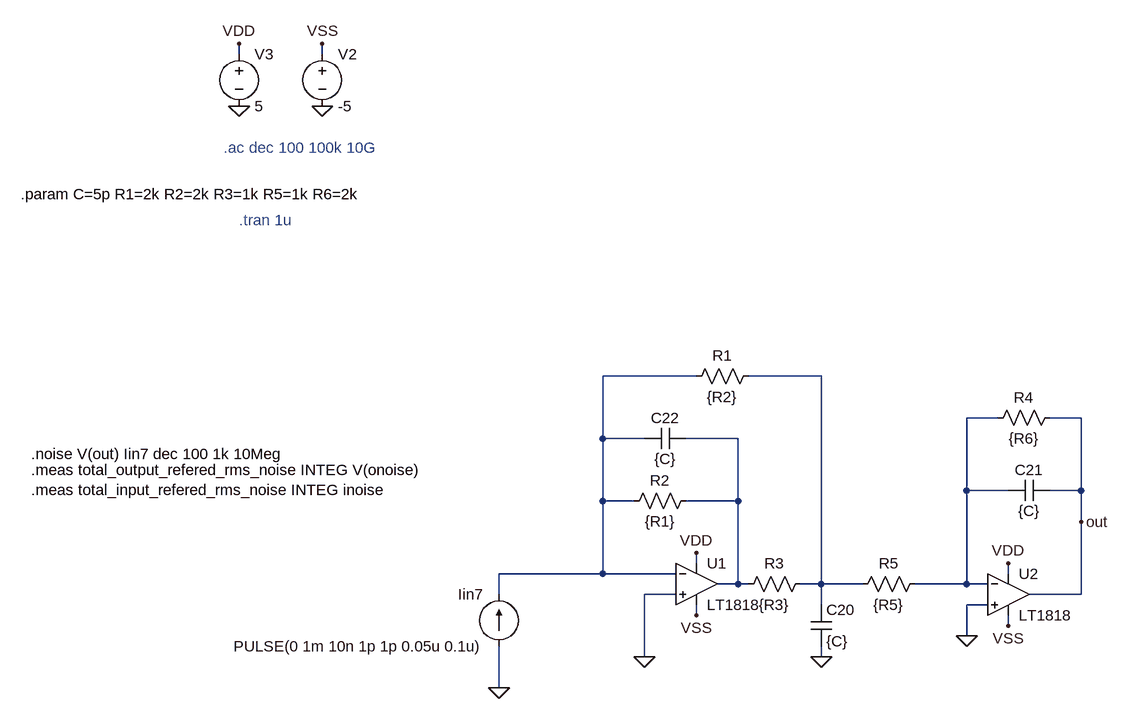
[diagram p0: schematic TIA-ALL_Z-LPF-Noise.asc]
TIA-ALL_Z-LPF-Noise.asc, the LTspice schematic file:
Version 4
SHEET 1 3536 3016
WIRE -128 -16 -128 -32
WIRE 0 -16 0 -32
WIRE 576 480 432 480
WIRE 768 480 656 480
WIRE 1040 544 992 544
WIRE 1168 544 1120 544
WIRE 432 576 432 480
WIRE 496 576 432 576
WIRE 640 576 560 576
WIRE 992 656 992 544
WIRE 1056 656 992 656
WIRE 1168 656 1168 544
WIRE 1168 656 1120 656
WIRE 432 672 432 576
WIRE 480 672 432 672
WIRE 640 672 640 576
WIRE 640 672 560 672
WIRE 1168 704 1168 656
WIRE 576 768 576 752
WIRE 432 784 432 672
WIRE 432 784 272 784
WIRE 544 784 432 784
WIRE 1056 784 1056 768
WIRE 640 800 640 672
WIRE 640 800 608 800
WIRE 656 800 640 800
WIRE 768 800 768 480
WIRE 768 800 736 800
WIRE 832 800 768 800
WIRE 992 800 992 656
WIRE 992 800 912 800
WIRE 1024 800 992 800
WIRE 272 816 272 784
WIRE 544 816 496 816
WIRE 1168 816 1168 704
WIRE 1168 816 1088 816
WIRE 768 832 768 800
WIRE 1024 832 992 832
WIRE 576 848 576 832
WIRE 1056 864 1056 848
WIRE 992 880 992 832
WIRE 496 912 496 816
WIRE 768 912 768 896
WIRE 272 960 272 896
FLAG 0 64 0
FLAG -128 64 0
FLAG -128 -32 VDD
FLAG 0 -32 VSS
FLAG 272 960 0
FLAG 496 912 0
FLAG 768 912 0
FLAG 992 880 0
FLAG 1056 768 VDD
FLAG 1056 864 VSS
FLAG 576 752 VDD
FLAG 576 848 VSS
FLAG 1168 704 out
SYMBOL voltage 0 -32 R0
WINDOW 123 0 0 Left 0
WINDOW 39 0 0 Left 0
SYMATTR InstName V2
SYMATTR Value -5
SYMBOL voltage -128 -32 R0
WINDOW 123 0 0 Left 0
WINDOW 39 0 0 Left 0
SYMATTR InstName V3
SYMATTR Value 5
SYMBOL current 272 896 R180
WINDOW 0 24 80 Left 2
WINDOW 3 24 0 Left 2
WINDOW 39 0 0 Left 0
SYMATTR InstName Iin7
SYMATTR Value PULSE(0 1m 10n 1p 1p 0.05u 0.1u)
SYMATTR Value2 AC 1
SYMBOL Cap 752 832 R0
SYMATTR InstName C20
SYMATTR Value {C}
SYMBOL Cap 1120 640 R90
WINDOW 0 0 32 VBottom 2
WINDOW 3 32 32 VTop 2
SYMATTR InstName C21
SYMATTR Value {C}
SYMBOL Cap 560 560 R90
WINDOW 0 0 32 VBottom 2
WINDOW 3 32 32 VTop 2
SYMATTR InstName C22
SYMATTR Value {C}
SYMBOL Res 672 464 R90
WINDOW 0 0 56 VBottom 2
WINDOW 3 32 56 VTop 2
SYMATTR InstName R1
SYMATTR Value {R2}
SYMBOL Res 576 656 R90
WINDOW 0 0 56 VBottom 2
WINDOW 3 32 56 VTop 2
SYMATTR InstName R2
SYMATTR Value {R1}
SYMBOL Res 752 784 R90
WINDOW 0 0 56 VBottom 2
WINDOW 3 32 56 VTop 2
SYMATTR InstName R3
SYMATTR Value {R3}
SYMBOL Res 1136 528 R90
WINDOW 0 0 56 VBottom 2
WINDOW 3 32 56 VTop 2
SYMATTR InstName R4
SYMATTR Value {R6}
SYMBOL Res 928 784 R90
WINDOW 0 0 56 VBottom 2
WINDOW 3 32 56 VTop 2
SYMATTR InstName R5
SYMATTR Value {R5}
SYMBOL LT1818 576 800 R0
SYMATTR InstName U1
SYMBOL LT1818 1056 816 R0
SYMATTR InstName U2
TEXT -152 128 Left 2 ;.ac dec 100 100k 10G
TEXT -464 200 Left 2 !.param C=5p R1=2k R2=2k R3=1k R5=1k R6=2k
TEXT -128 240 Left 2 ;.tran 1u
TEXT -448 600 Left 2 !.noise V(out) Iin7 dec 100 1k 10Meg
TEXT -448 624 Left 2 !.meas total_output_refered_rms_noise INTEG V(onoise)\n.meas total_input_refered_rms_noise INTEG inoise

The netlist it stands for:
* TIA-ALL_Z-LPF-Noise.asc
V2 VSS 0 -5
V3 VDD 0 5
Iin7 0 N001 PULSE(0 1m 10n 1p 1p 0.05u 0.1u) AC 1
C20 N002 0 {C}
C21 out N003 {C}
C22 N004 N001 {C}
R1 N002 N001 {R2}
R2 N004 N001 {R1}
R3 N002 N004 {R3}
R4 out N003 {R6}
R5 N003 N002 {R5}
XU1 0 N001 N004 VDD VSS LT1818  ; pins In+ In- OUT V+ V-
XU2 0 N003 out VDD VSS LT1818  ; pins In+ In- OUT V+ V-
* .ac dec 100 100k 10G
.param C=5p R1=2k R2=2k R3=1k R5=1k R6=2k
* .tran 1u
.noise V(out) Iin7 dec 100 1k 10Meg
.meas total_output_refered_rms_noise INTEG V(onoise)
.meas total_input_refered_rms_noise INTEG inoise
.lib LTC2.lib
.backanno
.end